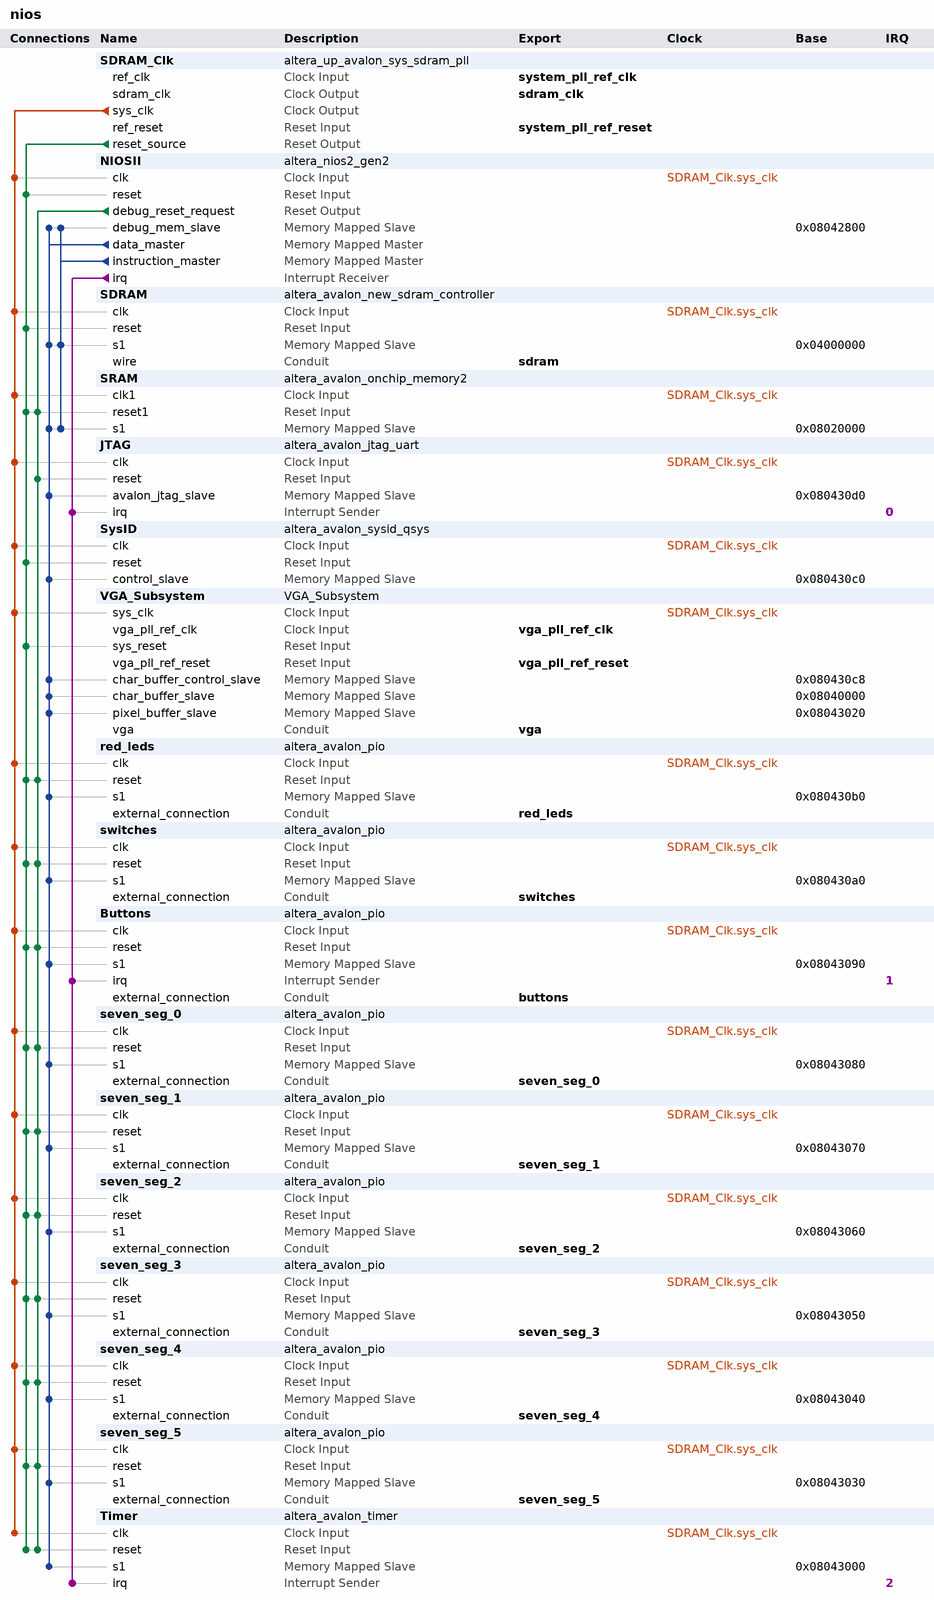
[diagram p0: system contents]
# Platform Designer (Qsys) system nios, Cyclone V 5CSEMA5F31C6
# Parameters at their usual value, and those the tool derives, are not listed.
package require -exact qsys 18.1
create_system nios
set_project_property DEVICE_FAMILY {Cyclone V}
set_project_property DEVICE 5CSEMA5F31C6

add_instance SDRAM_Clk altera_up_avalon_sys_sdram_pll 18.0
set_instance_parameter_value SDRAM_Clk CV_boards DE1-SoC
set_instance_parameter_value SDRAM_Clk gui_outclk 50.0
set_instance_parameter_value SDRAM_Clk gui_refclk 50.0

add_instance NIOSII altera_nios2_gen2 18.1
set_instance_parameter_value NIOSII dcache_size 2048
set_instance_parameter_value NIOSII exceptionSlave SDRAM.s1
set_instance_parameter_value NIOSII icache_size 4096
set_instance_parameter_value NIOSII impl Fast
set_instance_parameter_value NIOSII resetSlave SDRAM.s1

add_instance SDRAM altera_avalon_new_sdram_controller 18.1
set_instance_parameter_value SDRAM TAC 5.5
set_instance_parameter_value SDRAM TRCD 20.0
set_instance_parameter_value SDRAM TRP 20.0
set_instance_parameter_value SDRAM casLatency 3
set_instance_parameter_value SDRAM columnWidth 10
set_instance_parameter_value SDRAM dataWidth 16
set_instance_parameter_value SDRAM generateSimulationModel true
set_instance_parameter_value SDRAM model single_Micron_MT48LC4M32B2_7_chip
set_instance_parameter_value SDRAM numberOfBanks 4
set_instance_parameter_value SDRAM numberOfChipSelects 1
set_instance_parameter_value SDRAM powerUpDelay 100.0
set_instance_parameter_value SDRAM refreshPeriod 15.625
set_instance_parameter_value SDRAM rowWidth 13

add_instance SRAM altera_avalon_onchip_memory2 18.1
set_instance_parameter_value SRAM dataWidth 32
set_instance_parameter_value SRAM dualPort false
set_instance_parameter_value SRAM initMemContent true
set_instance_parameter_value SRAM initializationFileName onchip_mem.hex
set_instance_parameter_value SRAM memorySize 81920

add_instance JTAG altera_avalon_jtag_uart 18.1
set_instance_parameter_value JTAG simInteractiveOptions NO_INTERACTIVE_WINDOWS

add_instance SysID altera_avalon_sysid_qsys 18.1
set_instance_parameter_value SysID id 0

add_instance VGA_Subsystem VGA_Subsystem 1.0

add_instance red_leds altera_avalon_pio 18.1
set_instance_parameter_value red_leds direction Output
set_instance_parameter_value red_leds width 10

add_instance switches altera_avalon_pio 18.1
set_instance_parameter_value switches direction Input
set_instance_parameter_value switches width 10

add_instance Buttons altera_avalon_pio 18.1
set_instance_parameter_value Buttons captureEdge true
set_instance_parameter_value Buttons direction Input
set_instance_parameter_value Buttons edgeType FALLING
set_instance_parameter_value Buttons generateIRQ true
set_instance_parameter_value Buttons width 4

add_instance seven_seg_0 altera_avalon_pio 18.1
set_instance_parameter_value seven_seg_0 direction Output
set_instance_parameter_value seven_seg_0 width 7

add_instance seven_seg_1 altera_avalon_pio 18.1
set_instance_parameter_value seven_seg_1 direction Output
set_instance_parameter_value seven_seg_1 width 7

add_instance seven_seg_2 altera_avalon_pio 18.1
set_instance_parameter_value seven_seg_2 direction Output
set_instance_parameter_value seven_seg_2 width 7

add_instance seven_seg_3 altera_avalon_pio 18.1
set_instance_parameter_value seven_seg_3 direction Output
set_instance_parameter_value seven_seg_3 width 7

add_instance seven_seg_4 altera_avalon_pio 18.1
set_instance_parameter_value seven_seg_4 direction Output
set_instance_parameter_value seven_seg_4 width 7

add_instance seven_seg_5 altera_avalon_pio 18.1
set_instance_parameter_value seven_seg_5 direction Output
set_instance_parameter_value seven_seg_5 width 7

add_instance Timer altera_avalon_timer 18.1
set_instance_parameter_value Timer period 1
set_instance_parameter_value Timer periodUnits MSEC

# connections
add_connection SDRAM_Clk.sys_clk Buttons.clk clock
add_connection SDRAM_Clk.sys_clk JTAG.clk clock
add_connection SDRAM_Clk.sys_clk NIOSII.clk clock
add_connection SDRAM_Clk.sys_clk red_leds.clk clock
add_connection SDRAM_Clk.sys_clk SDRAM.clk clock
add_connection SDRAM_Clk.sys_clk seven_seg_0.clk clock
add_connection SDRAM_Clk.sys_clk seven_seg_1.clk clock
add_connection SDRAM_Clk.sys_clk seven_seg_2.clk clock
add_connection SDRAM_Clk.sys_clk seven_seg_3.clk clock
add_connection SDRAM_Clk.sys_clk seven_seg_4.clk clock
add_connection SDRAM_Clk.sys_clk seven_seg_5.clk clock
add_connection SDRAM_Clk.sys_clk SRAM.clk1 clock
add_connection SDRAM_Clk.sys_clk switches.clk clock
add_connection SDRAM_Clk.sys_clk SysID.clk clock
add_connection SDRAM_Clk.sys_clk Timer.clk clock
add_connection SDRAM_Clk.sys_clk VGA_Subsystem.sys_clk clock
add_connection NIOSII.debug_reset_request Buttons.reset reset
add_connection NIOSII.debug_reset_request JTAG.reset reset
add_connection NIOSII.debug_reset_request red_leds.reset reset
add_connection NIOSII.debug_reset_request seven_seg_0.reset reset
add_connection NIOSII.debug_reset_request seven_seg_1.reset reset
add_connection NIOSII.debug_reset_request seven_seg_2.reset reset
add_connection NIOSII.debug_reset_request seven_seg_3.reset reset
add_connection NIOSII.debug_reset_request seven_seg_4.reset reset
add_connection NIOSII.debug_reset_request seven_seg_5.reset reset
add_connection NIOSII.debug_reset_request SRAM.reset1 reset
add_connection NIOSII.debug_reset_request switches.reset reset
add_connection NIOSII.debug_reset_request Timer.reset reset
add_connection SDRAM_Clk.reset_source Buttons.reset reset
add_connection SDRAM_Clk.reset_source NIOSII.reset reset
add_connection SDRAM_Clk.reset_source red_leds.reset reset
add_connection SDRAM_Clk.reset_source SDRAM.reset reset
add_connection SDRAM_Clk.reset_source seven_seg_0.reset reset
add_connection SDRAM_Clk.reset_source seven_seg_1.reset reset
add_connection SDRAM_Clk.reset_source seven_seg_2.reset reset
add_connection SDRAM_Clk.reset_source seven_seg_3.reset reset
add_connection SDRAM_Clk.reset_source seven_seg_4.reset reset
add_connection SDRAM_Clk.reset_source seven_seg_5.reset reset
add_connection SDRAM_Clk.reset_source SRAM.reset1 reset
add_connection SDRAM_Clk.reset_source switches.reset reset
add_connection SDRAM_Clk.reset_source SysID.reset reset
add_connection SDRAM_Clk.reset_source Timer.reset reset
add_connection SDRAM_Clk.reset_source VGA_Subsystem.sys_reset reset
add_connection NIOSII.data_master Buttons.s1 avalon
set_connection_parameter_value NIOSII.data_master/Buttons.s1 baseAddress 0x08043090
add_connection NIOSII.data_master JTAG.avalon_jtag_slave avalon
set_connection_parameter_value NIOSII.data_master/JTAG.avalon_jtag_slave baseAddress 0x080430d0
add_connection NIOSII.data_master NIOSII.debug_mem_slave avalon
set_connection_parameter_value NIOSII.data_master/NIOSII.debug_mem_slave baseAddress 0x08042800
add_connection NIOSII.data_master red_leds.s1 avalon
set_connection_parameter_value NIOSII.data_master/red_leds.s1 baseAddress 0x080430b0
add_connection NIOSII.data_master SDRAM.s1 avalon
set_connection_parameter_value NIOSII.data_master/SDRAM.s1 baseAddress 0x04000000
add_connection NIOSII.data_master seven_seg_0.s1 avalon
set_connection_parameter_value NIOSII.data_master/seven_seg_0.s1 baseAddress 0x08043080
add_connection NIOSII.data_master seven_seg_1.s1 avalon
set_connection_parameter_value NIOSII.data_master/seven_seg_1.s1 baseAddress 0x08043070
add_connection NIOSII.data_master seven_seg_2.s1 avalon
set_connection_parameter_value NIOSII.data_master/seven_seg_2.s1 baseAddress 0x08043060
add_connection NIOSII.data_master seven_seg_3.s1 avalon
set_connection_parameter_value NIOSII.data_master/seven_seg_3.s1 baseAddress 0x08043050
add_connection NIOSII.data_master seven_seg_4.s1 avalon
set_connection_parameter_value NIOSII.data_master/seven_seg_4.s1 baseAddress 0x08043040
add_connection NIOSII.data_master seven_seg_5.s1 avalon
set_connection_parameter_value NIOSII.data_master/seven_seg_5.s1 baseAddress 0x08043030
add_connection NIOSII.data_master SRAM.s1 avalon
set_connection_parameter_value NIOSII.data_master/SRAM.s1 baseAddress 0x08020000
add_connection NIOSII.data_master switches.s1 avalon
set_connection_parameter_value NIOSII.data_master/switches.s1 baseAddress 0x080430a0
add_connection NIOSII.data_master SysID.control_slave avalon
set_connection_parameter_value NIOSII.data_master/SysID.control_slave baseAddress 0x080430c0
add_connection NIOSII.data_master Timer.s1 avalon
set_connection_parameter_value NIOSII.data_master/Timer.s1 baseAddress 0x08043000
add_connection NIOSII.data_master VGA_Subsystem.char_buffer_control_slave avalon
set_connection_parameter_value NIOSII.data_master/VGA_Subsystem.char_buffer_control_slave baseAddress 0x080430c8
add_connection NIOSII.data_master VGA_Subsystem.char_buffer_slave avalon
set_connection_parameter_value NIOSII.data_master/VGA_Subsystem.char_buffer_slave baseAddress 0x08040000
add_connection NIOSII.data_master VGA_Subsystem.pixel_buffer_slave avalon
set_connection_parameter_value NIOSII.data_master/VGA_Subsystem.pixel_buffer_slave baseAddress 0x08043020
add_connection NIOSII.instruction_master NIOSII.debug_mem_slave avalon
set_connection_parameter_value NIOSII.instruction_master/NIOSII.debug_mem_slave baseAddress 0x08042800
add_connection NIOSII.instruction_master SDRAM.s1 avalon
set_connection_parameter_value NIOSII.instruction_master/SDRAM.s1 baseAddress 0x04000000
add_connection NIOSII.instruction_master SRAM.s1 avalon
set_connection_parameter_value NIOSII.instruction_master/SRAM.s1 baseAddress 0x08020000
add_connection NIOSII.irq Buttons.irq interrupt
set_connection_parameter_value NIOSII.irq/Buttons.irq irqNumber 1
add_connection NIOSII.irq JTAG.irq interrupt
set_connection_parameter_value NIOSII.irq/JTAG.irq irqNumber 0
add_connection NIOSII.irq Timer.irq interrupt
set_connection_parameter_value NIOSII.irq/Timer.irq irqNumber 2

# exported interfaces
add_interface buttons conduit end
set_interface_property buttons EXPORT_OF Buttons.external_connection
add_interface red_leds conduit end
set_interface_property red_leds EXPORT_OF red_leds.external_connection
add_interface sdram conduit end
set_interface_property sdram EXPORT_OF SDRAM.wire
add_interface sdram_clk clock source
set_interface_property sdram_clk EXPORT_OF SDRAM_Clk.sdram_clk
add_interface seven_seg_0 conduit end
set_interface_property seven_seg_0 EXPORT_OF seven_seg_0.external_connection
add_interface seven_seg_1 conduit end
set_interface_property seven_seg_1 EXPORT_OF seven_seg_1.external_connection
add_interface seven_seg_2 conduit end
set_interface_property seven_seg_2 EXPORT_OF seven_seg_2.external_connection
add_interface seven_seg_3 conduit end
set_interface_property seven_seg_3 EXPORT_OF seven_seg_3.external_connection
add_interface seven_seg_4 conduit end
set_interface_property seven_seg_4 EXPORT_OF seven_seg_4.external_connection
add_interface seven_seg_5 conduit end
set_interface_property seven_seg_5 EXPORT_OF seven_seg_5.external_connection
add_interface switches conduit end
set_interface_property switches EXPORT_OF switches.external_connection
add_interface system_pll_ref_clk clock sink
set_interface_property system_pll_ref_clk EXPORT_OF SDRAM_Clk.ref_clk
add_interface system_pll_ref_reset reset sink
set_interface_property system_pll_ref_reset EXPORT_OF SDRAM_Clk.ref_reset
add_interface vga conduit end
set_interface_property vga EXPORT_OF VGA_Subsystem.vga
add_interface vga_pll_ref_clk clock sink
set_interface_property vga_pll_ref_clk EXPORT_OF VGA_Subsystem.vga_pll_ref_clk
add_interface vga_pll_ref_reset reset sink
set_interface_property vga_pll_ref_reset EXPORT_OF VGA_Subsystem.vga_pll_ref_reset

set_interconnect_requirement {$system} qsys_mm.clockCrossingAdapter HANDSHAKE
set_interconnect_requirement {$system} qsys_mm.enableEccProtection FALSE
set_interconnect_requirement {$system} qsys_mm.insertDefaultSlave FALSE
set_interconnect_requirement {$system} qsys_mm.maxAdditionalLatency 1

save_system nios.qsys
